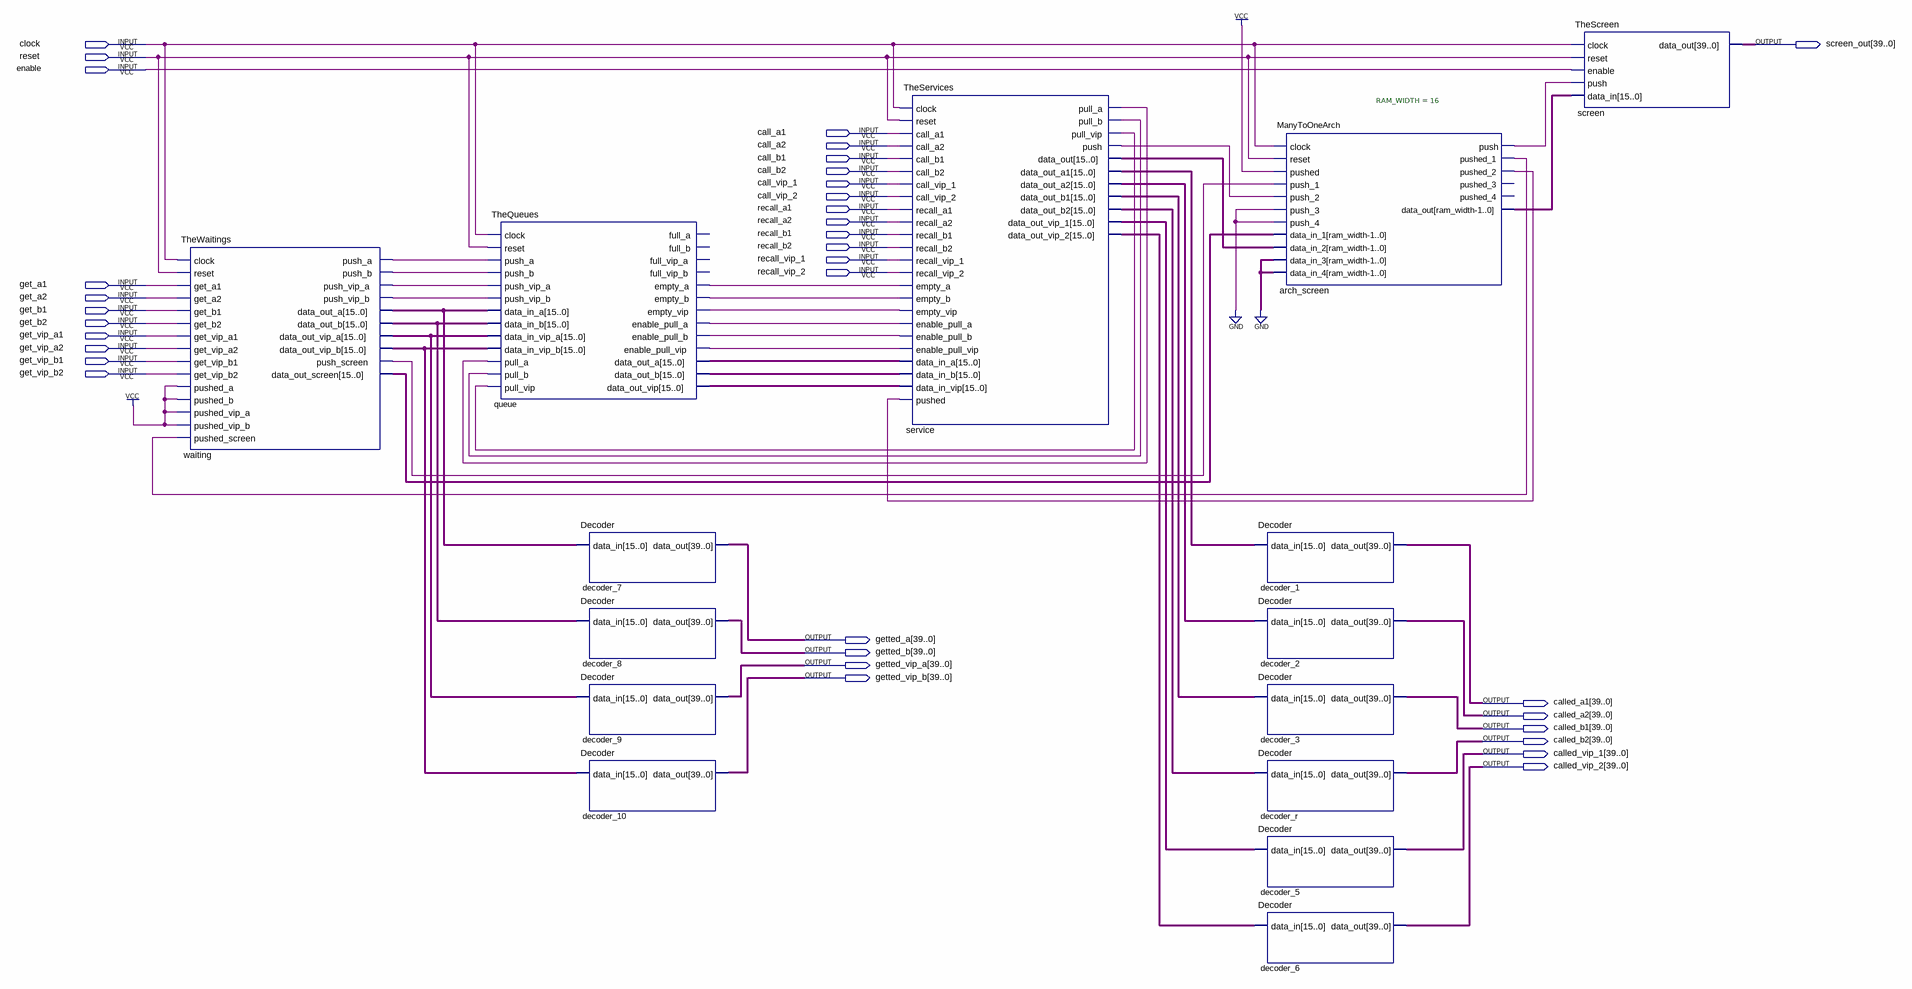
[diagram p0: schematic sheet]
// Quartus schematic CallPlatform.bdf as structural Verilog: 15 symbols, 34 pins
module CallPlatform (
  input  clock,
  input  reset,
  input  enable,
  input  call_a1,
  input  call_a2,
  input  call_b1,
  input  call_b2,
  input  call_vip_1,
  input  call_vip_2,
  input  recall_a1,
  input  recall_a2,
  input  recall_b1,
  input  recall_b2,
  input  recall_vip_1,
  input  recall_vip_2,
  input  get_a1,
  input  get_a2,
  input  get_b1,
  input  get_b2,
  input  get_vip_a1,
  input  get_vip_a2,
  input  get_vip_b1,
  input  get_vip_b2,
  output [39:0] screen_out,
  output [39:0] getted_a,
  output [39:0] getted_b,
  output [39:0] getted_vip_a,
  output [39:0] getted_vip_b,
  output [39:0] called_a1,
  output [39:0] called_a2,
  output [39:0] called_b1,
  output [39:0] called_b2,
  output [39:0] called_vip_1,
  output [39:0] called_vip_2
);

  wire arch_screen_push, arch_screen_pushed_1, arch_screen_pushed_2, queue_empty_a, queue_empty_b,
       queue_empty_vip, queue_enable_pull_a, queue_enable_pull_b, queue_enable_pull_vip, service_pull_a,
       service_pull_b, service_pull_vip, service_push, waiting_push_a, waiting_push_b, waiting_push_screen,
       waiting_push_vip_a, waiting_push_vip_b;
  wire [15:0] arch_screen_data_out, queue_data_out_a, queue_data_out_b, queue_data_out_vip, service_data_out,
       service_data_out_a1, service_data_out_a2, service_data_out_b1, service_data_out_b2,
       service_data_out_vip_1, service_data_out_vip_2, waiting_data_out_a, waiting_data_out_b,
       waiting_data_out_screen, waiting_data_out_vip_a, waiting_data_out_vip_b;

  TheWaitings waiting (
    .clock(clock), .reset(reset), .get_a1(get_a1), .get_a2(get_a2), .get_b1(get_b1), .get_b2(get_b2),
    .get_vip_a1(get_vip_a1), .get_vip_a2(get_vip_a2), .get_vip_b1(get_vip_b1), .get_vip_b2(get_vip_b2),
    .pushed_a(1'b1), .pushed_b(1'b1), .pushed_vip_a(1'b1), .pushed_vip_b(1'b1),
    .pushed_screen(arch_screen_pushed_1), .push_a(waiting_push_a), .push_b(waiting_push_b),
    .push_vip_a(waiting_push_vip_a), .push_vip_b(waiting_push_vip_b), .data_out_a(waiting_data_out_a),
    .data_out_b(waiting_data_out_b), .data_out_vip_a(waiting_data_out_vip_a),
    .data_out_vip_b(waiting_data_out_vip_b), .push_screen(waiting_push_screen),
    .data_out_screen(waiting_data_out_screen));
  TheQueues queue (
    .clock(clock), .reset(reset), .push_a(waiting_push_a), .push_b(waiting_push_b),
    .push_vip_a(waiting_push_vip_a), .push_vip_b(waiting_push_vip_b), .data_in_a(waiting_data_out_a),
    .data_in_b(waiting_data_out_b), .data_in_vip_a(waiting_data_out_vip_a),
    .data_in_vip_b(waiting_data_out_vip_b), .pull_a(service_pull_a), .pull_b(service_pull_b),
    .pull_vip(service_pull_vip), .empty_a(queue_empty_a), .empty_b(queue_empty_b),
    .empty_vip(queue_empty_vip), .enable_pull_a(queue_enable_pull_a), .enable_pull_b(queue_enable_pull_b),
    .enable_pull_vip(queue_enable_pull_vip), .data_out_a(queue_data_out_a), .data_out_b(queue_data_out_b),
    .data_out_vip(queue_data_out_vip));  // open: full_a, full_b, full_vip_a, full_vip_b
  Decoder decoder_7 (.data_in(waiting_data_out_a), .data_out(getted_a));
  Decoder decoder_8 (.data_in(waiting_data_out_b), .data_out(getted_b));
  Decoder decoder_9 (.data_in(waiting_data_out_vip_a), .data_out(getted_vip_a));
  Decoder decoder_10 (.data_in(waiting_data_out_vip_b), .data_out(getted_vip_b));
  TheServices service (
    .clock(clock), .reset(reset), .call_a1(call_a1), .call_a2(call_a2), .call_b1(call_b1), .call_b2(call_b2),
    .call_vip_1(call_vip_1), .call_vip_2(call_vip_2), .recall_a1(recall_a1), .recall_a2(recall_a2),
    .recall_b1(recall_b1), .recall_b2(recall_b2), .recall_vip_1(recall_vip_1), .recall_vip_2(recall_vip_2),
    .empty_a(queue_empty_a), .empty_b(queue_empty_b), .empty_vip(queue_empty_vip),
    .enable_pull_a(queue_enable_pull_a), .enable_pull_b(queue_enable_pull_b),
    .enable_pull_vip(queue_enable_pull_vip), .data_in_a(queue_data_out_a), .data_in_b(queue_data_out_b),
    .data_in_vip(queue_data_out_vip), .pushed(arch_screen_pushed_2), .pull_a(service_pull_a),
    .pull_b(service_pull_b), .pull_vip(service_pull_vip), .push(service_push), .data_out(service_data_out),
    .data_out_a1(service_data_out_a1), .data_out_a2(service_data_out_a2), .data_out_b1(service_data_out_b1),
    .data_out_b2(service_data_out_b2), .data_out_vip_1(service_data_out_vip_1),
    .data_out_vip_2(service_data_out_vip_2));
  Decoder decoder_1 (.data_in(service_data_out_a1), .data_out(called_a1));
  Decoder decoder_2 (.data_in(service_data_out_a2), .data_out(called_a2));
  Decoder decoder_3 (.data_in(service_data_out_b1), .data_out(called_b1));
  Decoder decoder_r (.data_in(service_data_out_b2), .data_out(called_b2));
  Decoder decoder_5 (.data_in(service_data_out_vip_1), .data_out(called_vip_1));
  Decoder decoder_6 (.data_in(service_data_out_vip_2), .data_out(called_vip_2));
  ManyToOneArch #(.RAM_WIDTH(16)) arch_screen (
    .clock(clock), .reset(reset), .pushed(1'b1), .push_1(waiting_push_screen), .push_2(service_push),
    .push_3(1'b0), .push_4(1'b0), .data_in_1(waiting_data_out_screen), .data_in_2(service_data_out),
    .data_in_3({16{1'b0}}), .data_in_4({16{1'b0}}), .push(arch_screen_push), .pushed_1(arch_screen_pushed_1),
    .pushed_2(arch_screen_pushed_2), .data_out(arch_screen_data_out));  // open: pushed_3, pushed_4
  TheScreen screen (
    .clock(clock), .reset(reset), .enable(enable), .push(arch_screen_push), .data_in(arch_screen_data_out),
    .data_out(screen_out));
endmodule
